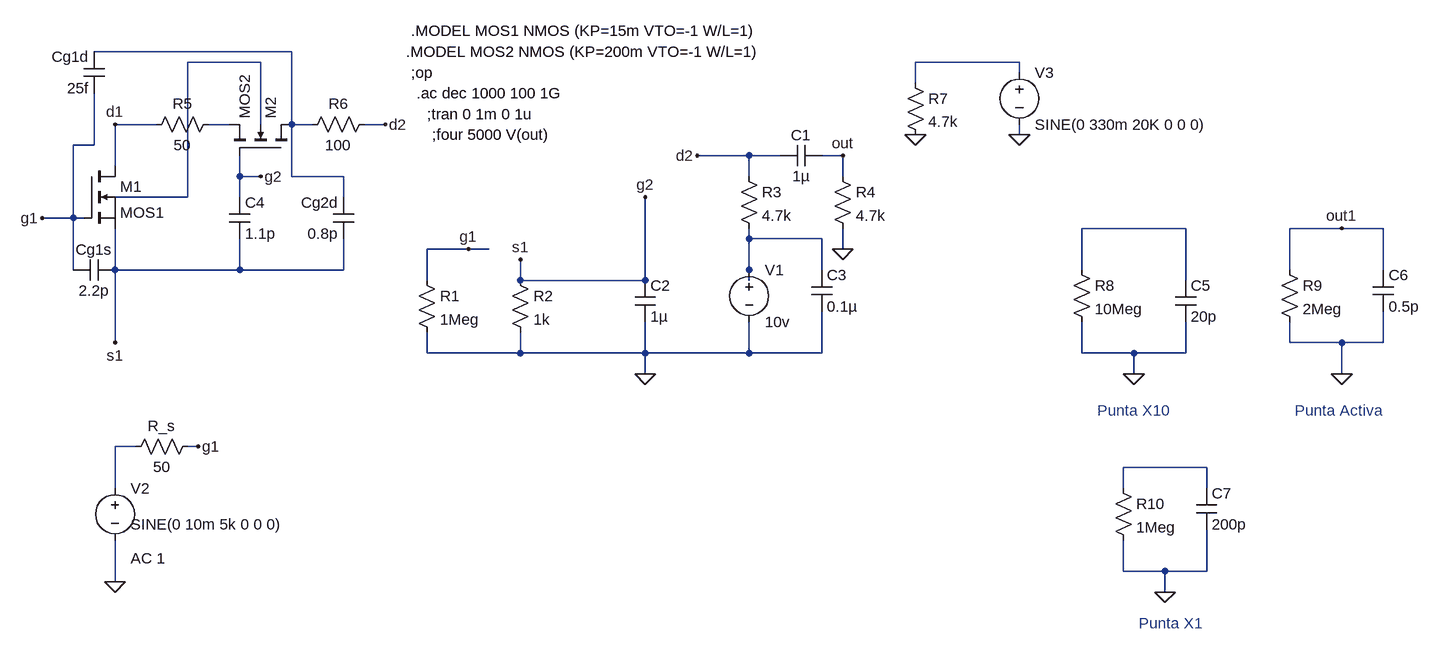
[diagram p0: schematic simulacionV2.asc]
simulacionV2.asc, the LTspice schematic file:
Version 4
SHEET 1 1388 832
WIRE -352 -64 -656 -64
WIRE -400 -48 -512 -48
WIRE 768 -48 608 -48
WIRE 768 -32 768 -48
WIRE 608 -16 608 -48
WIRE -560 48 -624 48
WIRE -448 48 -480 48
WIRE -400 48 -400 -48
WIRE -352 48 -352 -64
WIRE -352 48 -368 48
WIRE -320 48 -352 48
WIRE -208 48 -240 48
WIRE 768 64 768 48
WIRE -656 80 -656 0
WIRE -656 80 -688 80
WIRE 352 96 272 96
WIRE 400 96 352 96
WIRE 496 96 464 96
WIRE -624 112 -624 48
WIRE -432 128 -432 96
WIRE -400 128 -432 128
WIRE -352 128 -352 48
WIRE -272 128 -352 128
WIRE 352 128 352 96
WIRE 496 128 496 96
WIRE -512 160 -512 -48
WIRE -512 160 -624 160
WIRE -432 160 -432 128
WIRE -272 160 -272 128
WIRE -688 192 -688 80
WIRE -688 192 -736 192
WIRE -672 192 -688 192
WIRE 1024 208 864 208
WIRE 1264 208 1184 208
WIRE 1328 208 1264 208
WIRE 352 224 352 208
WIRE 464 224 352 224
WIRE -80 240 -144 240
WIRE -48 240 -80 240
WIRE 496 240 496 208
WIRE -688 272 -688 192
WIRE -624 272 -624 208
WIRE -624 272 -640 272
WIRE -432 272 -432 224
WIRE -432 272 -624 272
WIRE -272 272 -272 224
WIRE -272 272 -432 272
WIRE 352 272 352 224
WIRE 464 272 464 224
WIRE 864 272 864 208
WIRE 1184 272 1184 208
WIRE 1328 272 1328 208
WIRE -144 288 -144 240
WIRE 0 288 0 256
WIRE 192 288 192 160
WIRE 192 288 0 288
WIRE 352 288 352 272
WIRE 1024 288 1024 208
WIRE -624 384 -624 272
WIRE 1184 384 1184 352
WIRE 1264 384 1184 384
WIRE 1328 384 1328 336
WIRE 1328 384 1264 384
WIRE -144 400 -144 368
WIRE 0 400 0 368
WIRE 0 400 -144 400
WIRE 192 400 192 352
WIRE 192 400 0 400
WIRE 352 400 352 352
WIRE 352 400 192 400
WIRE 464 400 464 336
WIRE 464 400 352 400
WIRE 864 400 864 352
WIRE 944 400 864 400
WIRE 1024 400 1024 352
WIRE 1024 400 944 400
WIRE 192 432 192 400
WIRE 944 432 944 400
WIRE 1264 432 1264 384
WIRE -592 544 -624 544
WIRE -496 544 -512 544
WIRE 1056 576 928 576
WIRE -624 608 -624 544
WIRE 928 608 928 576
WIRE 1056 608 1056 576
WIRE 928 736 928 688
WIRE 992 736 928 736
WIRE 1056 736 1056 672
WIRE 1056 736 992 736
WIRE -624 752 -624 688
WIRE 992 768 992 736
FLAG 496 240 0
FLAG 192 432 0
FLAG -624 48 d1
FLAG -400 128 g2
FLAG -80 240 g1
FLAG 0 256 s1
FLAG 272 96 d2
FLAG 192 160 g2
FLAG -736 192 g1
FLAG -208 48 d2
FLAG -624 384 s1
FLAG -624 752 0
FLAG 768 64 0
FLAG 608 64 0
FLAG -496 544 g1
FLAG 944 432 0
FLAG 496 96 out
FLAG 1264 432 0
FLAG 992 768 0
FLAG 1264 208 out1
SYMBOL nmos4 -352 96 M270
SYMATTR InstName M2
SYMATTR Value MOS2
SYMBOL nmos -672 112 R0
SYMATTR InstName M1
SYMATTR Value MOS1
SYMBOL res -160 272 R0
SYMATTR InstName R1
SYMATTR Value 1Meg
SYMBOL res -16 272 R0
SYMATTR InstName R2
SYMATTR Value 1k
SYMBOL res 336 112 R0
SYMATTR InstName R3
SYMATTR Value 4.7k
SYMBOL res 480 112 R0
SYMATTR InstName R4
SYMATTR Value 4.7k
SYMBOL cap 400 112 R270
WINDOW 0 32 32 VTop 2
WINDOW 3 0 32 VBottom 2
SYMATTR InstName C1
SYMATTR Value 1µ
SYMBOL cap 176 288 R0
SYMATTR InstName C2
SYMATTR Value 1µ
SYMBOL voltage 352 256 R0
SYMATTR InstName V1
SYMATTR Value 10v
SYMBOL cap 448 272 R0
SYMATTR InstName C3
SYMATTR Value 0.1µ
SYMBOL res -464 32 R90
WINDOW 0 0 56 VBottom 2
WINDOW 3 32 56 VTop 2
SYMATTR InstName R5
SYMATTR Value 50
SYMBOL cap -624 256 R90
WINDOW 0 0 32 VBottom 2
WINDOW 3 32 32 VTop 2
SYMATTR InstName Cg1s
SYMATTR Value 2.2p
SYMBOL cap -640 0 R180
WINDOW 0 24 56 Left 2
WINDOW 3 24 8 Left 2
SYMATTR InstName Cg1d
SYMATTR Value 25f
SYMBOL cap -256 224 R180
WINDOW 0 24 56 Left 2
WINDOW 3 24 8 Left 2
SYMATTR InstName Cg2d
SYMATTR Value 0.8p
SYMBOL res -224 32 R90
WINDOW 0 0 56 VBottom 2
WINDOW 3 32 56 VTop 2
SYMATTR InstName R6
SYMATTR Value 100
SYMBOL cap -448 160 R0
SYMATTR InstName C4
SYMATTR Value 1.1p
SYMBOL voltage -624 592 R0
WINDOW 123 24 124 Left 2
WINDOW 39 24 44 Left 2
WINDOW 3 24 72 Left 2
SYMATTR Value2 AC 1
SYMATTR Value SINE(0 10m 5k 0 0 0)
SYMATTR InstName V2
SYMBOL voltage 768 -48 R0
WINDOW 123 0 0 Left 0
WINDOW 39 0 0 Left 0
SYMATTR InstName V3
SYMATTR Value SINE(0 330m 20K 0 0 0)
SYMBOL res 592 -32 R0
SYMATTR InstName R7
SYMATTR Value 4.7k
SYMBOL res 848 256 R0
SYMATTR InstName R8
SYMATTR Value 10Meg
SYMBOL cap 1008 288 R0
SYMATTR InstName C5
SYMATTR Value 20p
SYMBOL res 1168 256 R0
SYMATTR InstName R9
SYMATTR Value 2Meg
SYMBOL cap 1312 272 R0
SYMATTR InstName C6
SYMATTR Value 0.5p
SYMBOL res 912 592 R0
SYMATTR InstName R10
SYMATTR Value 1Meg
SYMBOL cap 1040 608 R0
SYMATTR InstName C7
SYMATTR Value 200p
SYMBOL res -496 528 R90
WINDOW 0 0 56 VBottom 2
WINDOW 3 32 56 VTop 2
SYMATTR InstName R_s
SYMATTR Value 50
TEXT -168 -96 Left 2 !.MODEL MOS1 NMOS (KP=15m VTO=-1 W/L=1)
TEXT -176 -64 Left 2 !.MODEL MOS2 NMOS (KP=200m VTO=-1 W/L=1)
TEXT -168 -32 Left 2 !;op
TEXT -160 0 Left 2 !.ac dec 1000 100 1G
TEXT -144 32 Left 2 !;tran 0 1m 0 1u
TEXT 888 488 Left 2 ;Punta X10
TEXT 1192 488 Left 2 ;Punta Activa
TEXT 952 816 Left 2 ;Punta X1
TEXT -136 64 Left 2 !;four 5000 V(out)

The netlist it stands for:
* simulacionV2.asc
M2 N001 s1 N004 N002 MOS2
M1 d1 g1 s1 s1 MOS1
R1 g1 0 1Meg
R2 s1 0 1k
R3 d2 N006 4.7k
R4 out 0 4.7k
C1 d2 out 1µ
C2 s1 0 1µ
V1 N006 0 10v
C3 N006 0 0.1µ
R5 N004 d1 50
Cg1s s1 g1 2.2p
Cg1d g1 N001 25f
Cg2d s1 N001 0.8p
R6 d2 N001 100
C4 s1 s1 1.1p
V2 N007 0 SINE(0 10m 5k 0 0 0) AC 1
V3 N003 0 SINE(0 330m 20K 0 0 0)
R7 N003 0 4.7k
R8 N005 0 10Meg
C5 N005 0 20p
R9 out1 0 2Meg
C6 out1 0 0.5p
R10 N008 0 1Meg
C7 N008 0 200p
R_s g1 N007 50
.model NMOS NMOS
.model PMOS PMOS
.lib standard.mos
.MODEL MOS1 NMOS (KP=15m VTO=-1 W/L=1)
.MODEL MOS2 NMOS (KP=200m VTO=-1 W/L=1)
;op
.ac dec 1000 100 1G
;tran 0 1m 0 1u
* Punta X10
* Punta Activa
* Punta X1
;four 5000 V(out)
.backanno
.end